# EAGLE design Gamma-BOTTOM-Version2 (EAGLE 9.5.2)
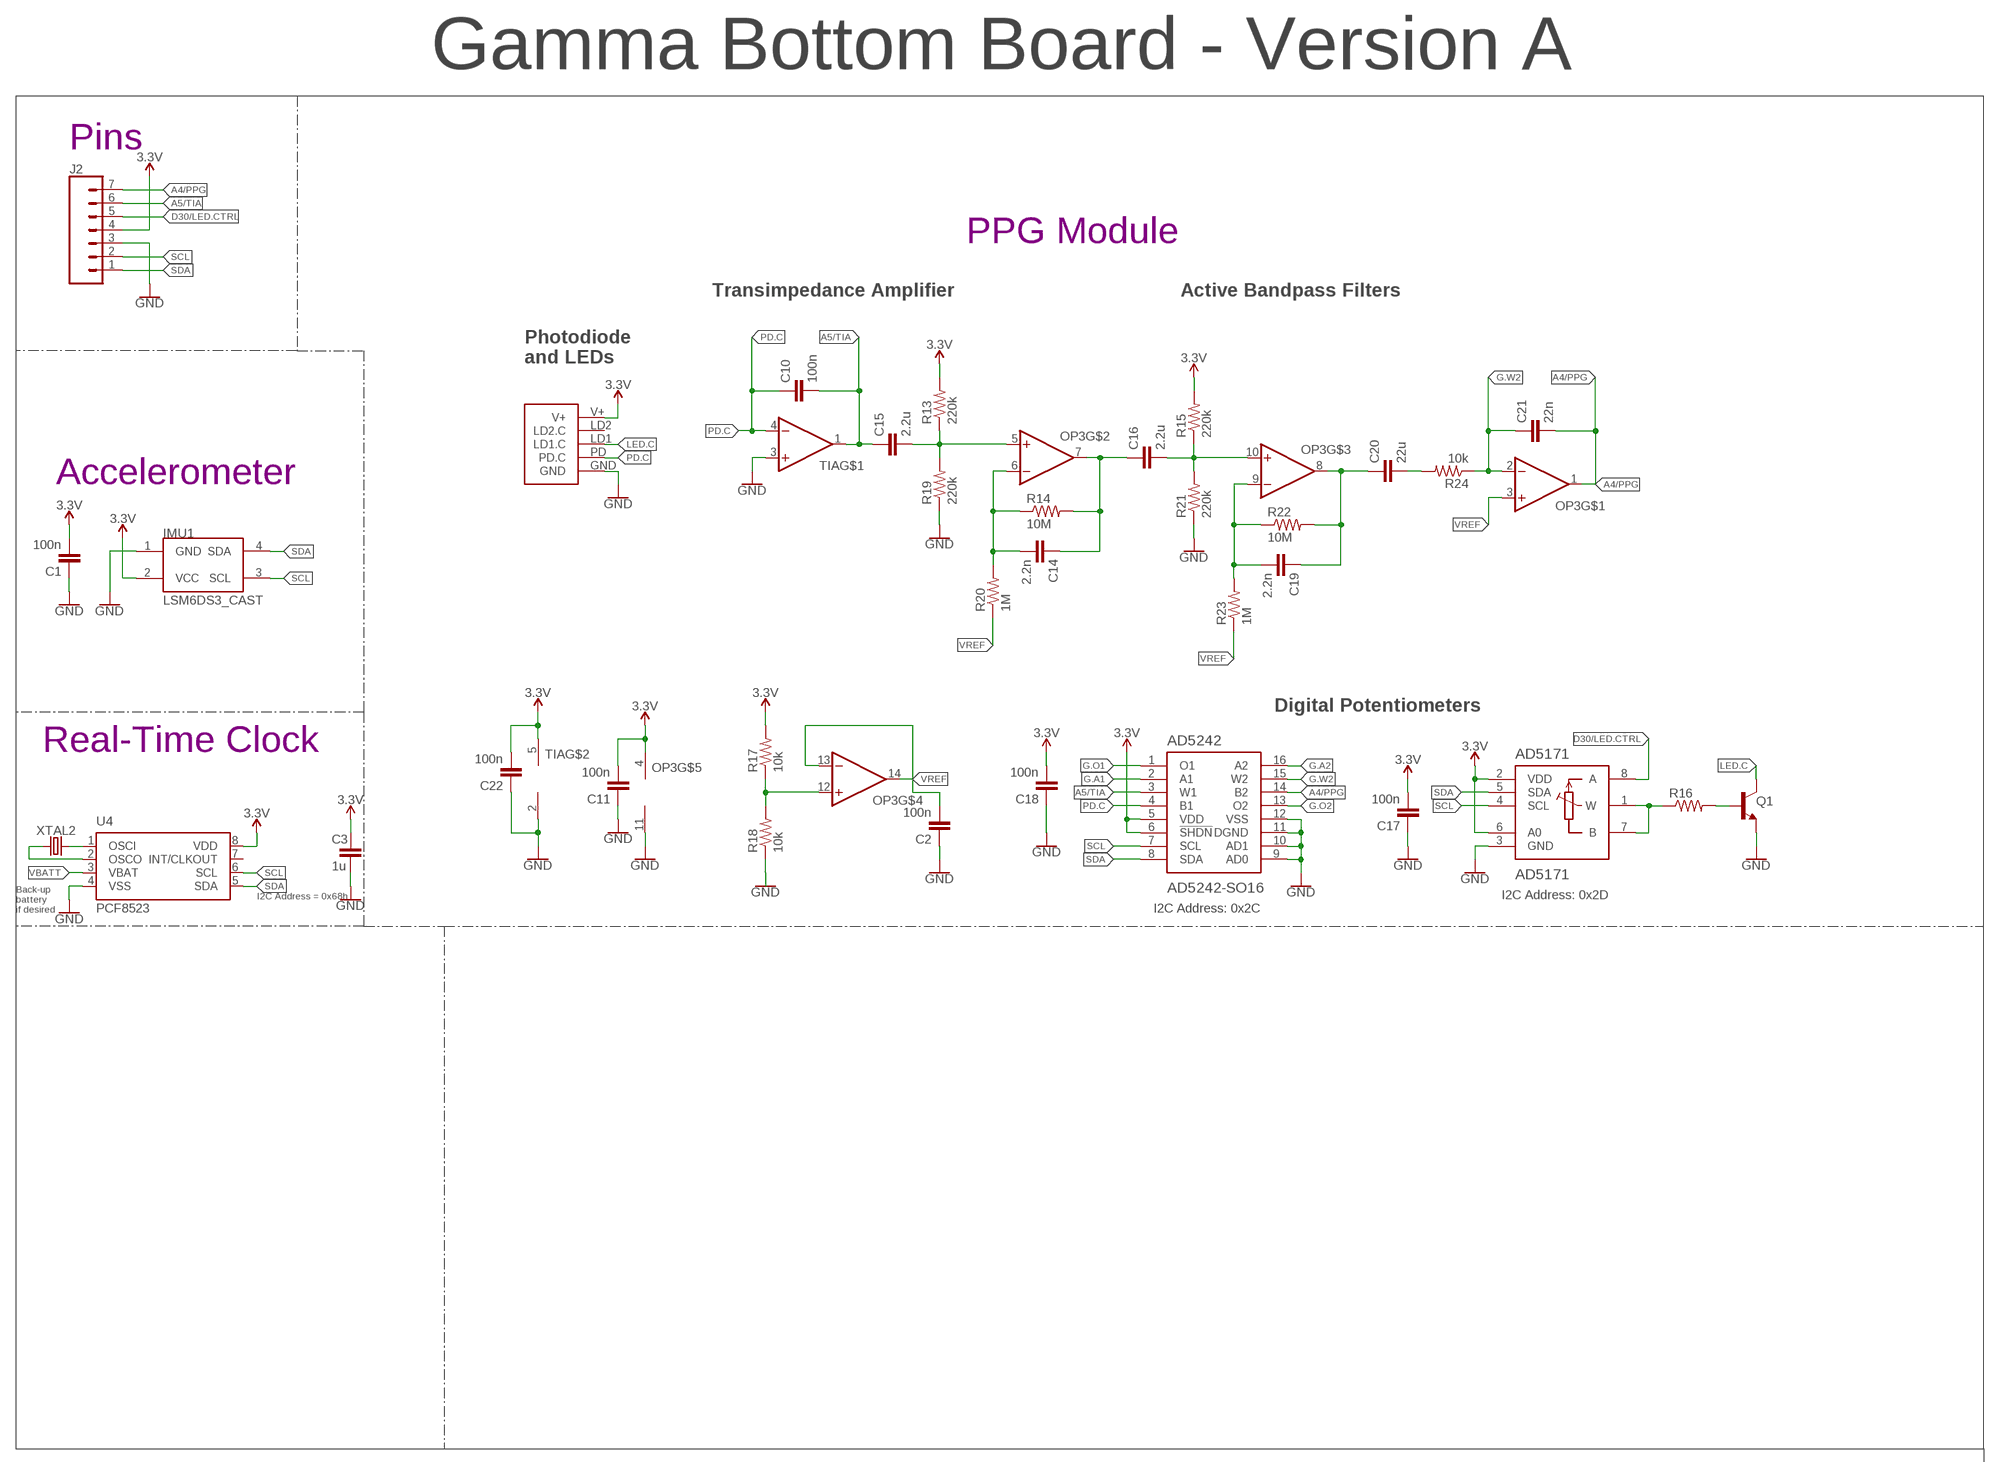
[diagram p0: schematic, sheet 1]

## Parts
AD5171  AD5171  [SOT-23-8]
AD5242  AD5242-SO16  [SO16]
C1  100n  CAPACITOR0603  [C0603]
C2  100n  CAPACITOR0603  [C0603]
C3  1u  CAPACITOR0603  [C0603]
C10  100n  CAPACITOR0603  [C0603]
C11  100n  CAPACITOR0603  [C0603]
C14  2.2n  CAPACITOR0603  [C0603]
C15  2.2u  CAPACITOR0603  [C0603]
C16  2.2u  CAPACITOR0603  [C0603]
C17  100n  CAPACITOR0603  [C0603]
C18  100n  CAPACITOR0603  [C0603]
C19  2.2n  CAPACITOR0603  [C0603]
C20  22u  CAPACITOR0603  [C0603]
C21  22n  CAPACITOR0603  [C0603]
C22  100n  CAPACITOR0603  [C0603]
IMU1  LSM6DS3_CAST  [LSM6DS3_CAST]
J2  CONN_07-1.27MM  [1X07_1.27MM]
OP3  OP-QUAD-SO14  [SO14]
Q1  NPN-GENERIC  [SOT23-3]
R13  220k  RESISTOR0603  [R0603]
R14  10M  RESISTOR0603  [R0603]
R15  220k  RESISTOR0603  [R0603]
R16  RESISTOR0603  [R0603]
R17  10k  RESISTOR0402  [R0402]
R18  10k  RESISTOR0402  [R0402]
R19  220k  RESISTOR0603  [R0603]
R20  1M  RESISTOR0603  [R0603]
R21  220k  RESISTOR0603  [R0603]
R22  10M  RESISTOR0603  [R0603]
R23  1M  RESISTOR0603  [R0603]
R24  10k  RESISTOR0603  [R0603]
TIA  OP-SINGLEOT  [SOT23-5]
U4  PCF8523  [SO8]
U$3  PPG.MODULE.2  [PPG.MODULE.2]
XTAL2  32.7680kHz  CRYSTALECS-.327-12.5-12-C-TR  [2-SMD.NOLEAD.2.0MMTO1.2MM]

## Nets
3.3V: AD5171.2(VDD) AD5171.6(A0) AD5242.5(VDD) AD5242.6(!SHDN) C1.2 C3.1 C11.2 C17.2 C18.2 C22.2 IMU1.2(VCC) J2.4 OP3.4(V+) R13.2 R15.2 R17.2 TIA.5(V+) U4.8(VDD) U$3.V+
A4/PPG: AD5242.14(B2) C21.2 J2.7 OP3.1(OUT)
A5/TIA: AD5242.3(W1) C10.2 C15.1 J2.6 TIA.1(OUT)
D30/LED.CTRL: AD5171.8(A) J2.5
G.A1: AD5242.2(A1)
G.A2: AD5242.16(A2)
G.O1: AD5242.1(O1)
G.O2: AD5242.13(O2)
G.W2: AD5242.15(W2) C21.1 OP3.2(-IN) R24.1
GND: AD5171.3(GND) AD5242.9(AD0) AD5242.10(AD1) AD5242.11(DGND) AD5242.12(VSS) C1.1 C2.1 C3.2 C11.1 C17.1 C18.1 C22.1 IMU1.1(GND) J2.3 OP3.11(V-) Q1.2(E) R18.1 R19.1 R21.1 TIA.2(V-) TIA.3(+IN) U4.4(VSS) U$3.GND
LED.C: Q1.3(C) U$3.LD1(LD1.C)
N$1: U4.2(OSCO) XTAL2.P$1
N$2: U4.1(OSCI) XTAL2.P$2
N$8: Q1.1(B) R16.2
N$9: AD5171.1(W) AD5171.7(B) R16.1
N$10: OP3.12(+IN) R17.1 R18.2
N$13: C15.2 OP3.5(+IN) R13.1 R19.2
N$15: C14.2 OP3.6(-IN) R14.1 R20.2
N$16: C14.1 C16.1 OP3.7(OUT) R14.2
N$17: C16.2 OP3.10(+IN) R15.1 R21.2
N$18: C19.2 OP3.9(-IN) R22.1 R23.2
N$19: C19.1 C20.1 OP3.8(OUT) R22.2
N$20: C20.2 R24.2
PD.C: AD5242.4(B1) C10.1 TIA.4(-IN) U$3.PD(PD.C)
SCL: AD5171.4(SCL) AD5242.7(SCL) IMU1.3(SCL) J2.2 U4.6(SCL)
SDA: AD5171.5(SDA) AD5242.8(SDA) IMU1.4(SDA) J2.1 U4.5(SDA)
VBATT: U4.3(VBAT)
VREF: C2.2 OP3.3(+IN) OP3.13(-IN) OP3.14(OUT) R20.1 R23.1
Unconnected: U4.7(INT/CLKOUT) U$3.LD2(LD2.C)

## Notes on the sheet
- Gamma Bottom Board - Version A
- Pins
- PPG Module
- Transimpedance Amplifier | Active Bandpass Filters
- Photodiode
  and LEDs
- Accelerometer
- Digital Potentiometers
- Real-Time Clock
- I2C Address = 0x68h | I2C Address: 0x2D
- Back-up
  battery
  if desired
- I2C Address: 0x2C

## Library data of the parts
AD5171 = LinnesLab-DigitalIC:AD5171
AD5242 = LinnesLab-DigitalIC:AD5242
C1-C3 C10 C11 C14-C22 = LinnesLab-Passives:CAPACITOR
IMU1 = LinnesLab-Sensors:LSM6DS3_CAST
J2 = LinnesLab-Connectors:CONN_07: Multi connection point. Often used as Generic Header-pin footprint for 0.1 inch spaced/style header connections On any of the 0.1 inch spaced packages, you can populate with these: Break Away Headers - Straight <https://www.sparkfun.com/products/116> (PRT-00116) Break Away Male Headers - Right Angle <https://www.sparkfun.com/products/553> (PRT-00553) Female Headers <https://www.sparkfun.com/products/115> (PRT-00115) Break Away Headers - Machine Pin <https://www.sparkfun.com/products/117> (PRT-00117) Break Away Female Headers - Swiss Machine Pin <https://www.sparkfun.com/products/743> (PRT-00743) For SCREWTERMINALS and SPRING TERMINALS visit here: Screw Terimnals on SparkFun.com <https://www.sparkfun.com/search/results?term=Screw+Terminals> (5mm/3.5mm/2.54mm spacing) This device is also useful as a general connection point to wire up your design to another part of your project. Our various solder wires solder well into these plated through hole pads. Hook-Up Wire - Assortment (Stranded, 22 AWG) <https://www.sparkfun.com/products/11375> (PRT-11375) Hook-Up Wire - Assortment (Solid Core, 22 AWG) <https://www.sparkfun.com/products/11367> (PRT-11367) View the entire wire category on our website here <https://www.sparkfun.com/categories/141> Special notes: Molex polarized connector foot print use with SKU : PRT-08231 with associated crimp pins and housings. 1MM SMD Version SKU: PRT-10208 NOTES ON THE VARIANTS LOCK and LOCK_LONGPADS... This footprint was designed to help hold the alignment of a through-hole component (i.e. 6-pin header) while soldering it into place. You may notice that each hole has been shifted either up or down by 0.005 of an inch from it's more standard position (which is a perfectly straight line). This slight alteration caused the pins (the squares in the middle) to touch the edges of the holes. Because they are alternating, it causes a "brace" to hold the component in place. 0.005 has proven to be the perfect amount of "off-center" position when using our standard breakaway headers. Although looks a little odd when you look at the bare footprint, once you have a header in there, the alteration is very hard to notice. Also,if you push a header all the way into place, it is covered up entirely on the bottom side.
OP3 = LinnesLab-AnalogIC:OP-QUAD: General symbol and footprints for Quad Op Amps. Use with any standard general purpose op amp.
Q1 = LinnesLab-DiscreteSemi:NPN
R13-R24 = LinnesLab-Passives:RESISTOR
TIA = LinnesLab-AnalogIC:OP-SINGLE: Single Op Amp 2.7V to 6.0V Single Supply CMOS Source: http://ww1.microchip.com/downloads/en/DeviceDoc/21314g.pdf
U4 = LinnesLab-Clocks:PCF8523; DIGIKEY: 568-5306-1-ND; I2C_ADDRESS: 0x68h; MFN: PCF8523T/1,118; MFN_MANUFACTURER: NXP USA Inc.
U$3 = LinnesLab-Connectors:PPG.MODULE.2: Digi-Key Part Number: S9014E-50-ND Manufacturer Part Number: GRPB501VWVN-RC Description: 1mm insulation height 0.05in pitch 50 positions
XTAL2 = LinnesLab-Clocks:CRYSTAL; DIGIKEY: XC2288CT-ND; FREQ: 32.7680KHZ; LOAD_CAP: 12.5pF

## Board
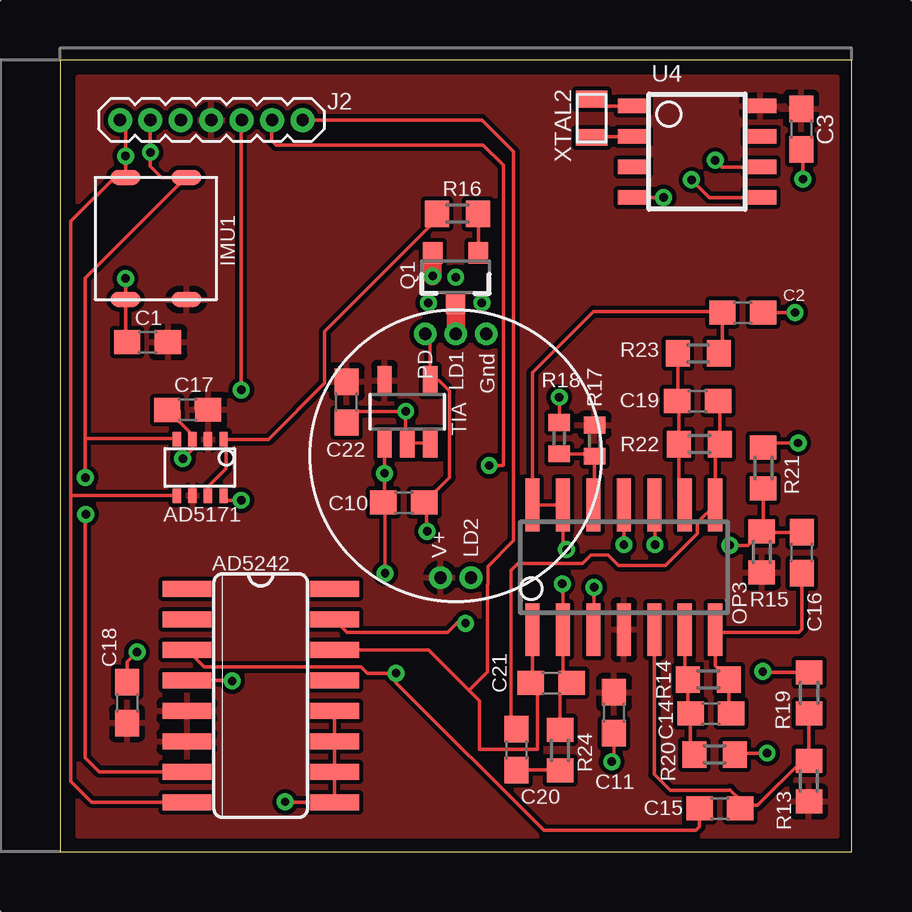
[diagram p1: board, top side]
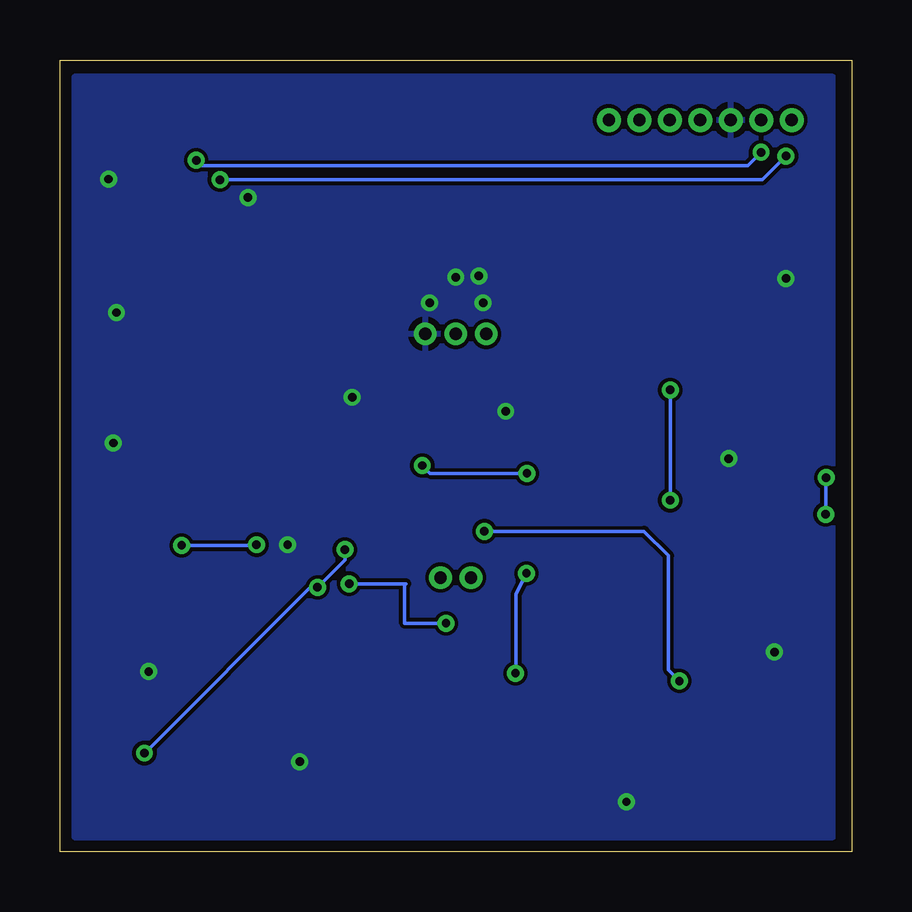
[diagram p2: board, bottom side, seen from below]

Size 33 x 33 mm. Coordinates in mm from the lower left corner, seen from the top.
Outline: 0,0 33,0 33,33 0,33 0,0
Copper layers (1*16): Top 0.0356mm / dielectric 1.5011mm / Bottom 0.0356mm
Design rules "LaenPCBOrder": minimum track width 6mil, minimum drill 13mil, track to track 6mil, track to pad 6mil, pad to pad 6mil, via to via 6mil, smd to smd 6mil, copper to edge 15mil, drill to drill 6mil, minimum pad ring 7mil, minimum via ring 7mil, stop-mask expansion 3mil, vias tented up to drill 0mil, thermal gap 10mil

### Footprints (pad centres in the part's own frame; a part is rotated, then mirrored left to right if it is on the bottom)
SOT-23-8 = smd 0.35 x 0.6: 1 -0.991,-1.176; 2 -0.341,-1.176; 3 0.309,-1.176; 4 0.959,-1.176; 5 0.959,1.176; 6 0.309,1.176; 7 -0.341,1.176; 8 -0.991,1.176
SO16 = smd 0.66 x 2.032: 1 -4.445,-3.073; 2 -3.175,-3.073; 3 -1.905,-3.073; 4 -0.635,-3.073; 5 0.635,-3.073; 6 1.905,-3.073; 7 3.175,-3.073; 8 4.445,-3.073; 9 4.445,3.073; 10 3.175,3.073; 11 1.905,3.073; 12 0.635,3.073; 13 -0.635,3.073; 14 -1.905,3.073; 15 -3.175,3.073; 16 -4.445,3.073
C0603 = smd 1.1 x 1: 1 -0.85,0; 2 0.85,0
LSM6DS3_CAST = smd 0.635 x 1.27: 1 -2.54,1.27; 2 -2.54,-1.27; 3 2.54,-1.27; 4 2.54,1.27
1X07_1.27MM = drill 0.508 pad 1: 1 0,0; 2 1.27,0; 3 2.54,0; 4 3.81,0; 5 5.08,0; 6 6.35,0; 7 7.62,0
SO14 = smd 0.6 x 2.2: 1 -3.81,-2.6; 2 -2.54,-2.6; 3 -1.27,-2.6; 4 0,-2.6; 5 1.27,-2.6; 6 2.54,-2.6; 7 3.81,-2.6; 8 3.81,2.6; 9 2.54,2.6; 10 1.27,2.6; 11 0,2.6; 12 -1.27,2.6; 13 -2.54,2.6; 14 -3.81,2.6
SOT23-3 = smd 0.8 x 0.9: 1 -0.95,-1; 2 0.95,-1; 3 0,1.1
R0603 = smd 1 x 1.1: 1 -0.85,0; 2 0.85,0
R0402 = smd 0.7 x 0.9: 1 -0.65,0; 2 0.65,0
SOT23-5 = smd 0.6 x 1.2: 1 -0.95,-1.306; 2 0,-1.306; 3 0.95,-1.306; 4 0.95,1.306; 5 -0.95,1.306
SO8 = smd 1.3 x 0.6: 1 -2.65,1.905; 2 -2.65,0.635; 3 -2.65,-0.635; 4 -2.65,-1.905; 5 2.65,-1.905; 6 2.65,-0.635; 7 2.65,0.635; 8 2.65,1.905
PPG.MODULE.2 = drill 0.508 pad 0.94: GND 1.27,5.08; LD1 0,5.08; LD2 0.635,-5.08; PD -1.27,5.08; V+ -0.635,-5.08
2-SMD.NOLEAD.2.0MMTO1.2MM = smd 0.7 x 1.3: P$1 -0.8,0; P$2 0.8,0

### Placement (x,y rotation side)
AD5171  5.83,16.01 180 top
AD5242  8.37,6.5 270 top
C1  3.65,21.23 0 top
C2  28.46,22.47 180 top
C3  30.9,30.11 270 top
C10  14.34,14.55 180 top
C11  23.1,5.79 90 top
C14  27.14,5.75 180 top
C15  27.51,1.79 0 top
C16  30.93,12.46 90 top
C17  5.32,18.41 0.4 top
C18  2.8,6.2 270 top
C19  26.58,18.79 180 top
C20  19.02,4.25 270 top
C21  20.48,7.02 180 top
C22  11.95,18.73 90 top
IMU1  4,25.56 90 top
J2  2.5,30.5 0 top
OP3  23.51,11.85 0 top
Q1  16.49,23.96 180 top
R13  31.23,2.94 270 top
R14  27.03,7.17 0 top
R15  29.25,12.49 270 top
R16  16.57,26.59 0 top
R17  22.29,17.13 90 top
R18  20.82,17.23 270 top
R19  31.23,6.62 270 top
R20  27.29,4.05 180 top
R21  29.32,15.99 270 top
R22  26.65,16.98 0 top
R23  26.61,20.76 180 top
R24  20.85,4.23 270 top
TIA  14.48,18.33 0 top
U4  26.56,29.17 0 top
U$3  16.5,16.5 0 top
XTAL2  22.16,30.57 90 top

### Tracks (layer width: path | path; a pad name or v marks a point on that pad's centre or on a via)
3.3V
  pour Top (isolate 0.178): 0.9,32.27 32.37,32.27 32.37,32.2 32.37,0.65 32.04,0.65 0.78,0.65 0.78,32.27
A4/PPG
  Top 0.152: AD5242.14 15.38,8.4 17.06,6.72 | 17.06,6.72 17.49,6.29 17.49,4.26 19.9,4.26 19.9,6.75 C21.2 19.7,7.09 OP3.1 | 17.06,6.72 17.82,7.48 17.82,11.12 17.83,11.13 17.83,11.89 18.91,12.97 18.91,29.17 17.59,30.5 J2.7
A5/TIA  (via drill 0.35)
  Top 0.152: TIA.1 v13.53,15.76 13.53,14.59 C10.2 13.55,14.48 v13.55,11.6 | v17.9,16.09 18.45,16.09 18.48,16.12 18.48,28.61 17.64,29.45 9.01,29.45 8.83,29.63 8.83,30.48 J2.6 | AD5242.3 6.01,7.69 12.55,7.69 12.81,7.43 v14.01,7.43 14.01,7.04 20.17,0.88 26.51,0.88 26.66,1.03 C15.1
  Bottom 0.152: v17.9,16.09 17.57,15.76 v13.53,15.76 | v13.55,11.6 13.98,10.73 13.98,7.43 v14.01,7.43
D30/LED.CTRL  (via drill 0.35)
  Top 0.152: v7.56,14.64 7.01,14.64 AD5171.8 | v7.56,19.24 7.56,30.48 J2.5
  Bottom 0.152: v7.56,14.64 v7.56,19.24
G.W2  (via drill 0.35)
  Top 0.152: R24.1 20.85,6.54 C21.1 20.97,7.38 OP3.2 20.97,11.14 v20.94,11.16 | AD5242.15 11.98,9.14 16.15,9.14 16.63,9.62 16.8,9.62 v16.91,9.51
  Bottom 0.152: v20.94,11.16 18.58,11.16 18.63,11.11 18.63,9.51 v16.91,9.51
GND  (via drill 0.35)
  Top 0.152: v20.82,18.94 R18.1 | OP3.11 v23.51,12.79 | R21.1 29.51,17.03 v30.77,17.03 | v29.3,7.51 29.34,7.47 R19.1 | C11.1 23.1,3.85 v23,3.75 | C22.1 12.42,18.35 v14.42,18.35 14.42,17.09 TIA.2 TIA.3 | AD5242.12 AD5242.11 AD5242.10 AD5242.9 9.41,2.05 v9.39,2.07 | v3.21,8.32 2.8,7.9 C18.1 | v2.73,23.89 IMU1.1 2.73,21.3 C1.1 | C17.1 5.52,17.36 AD5171.3 5.52,16.78 v5.12,16.38 | C2.1 v30.65,22.47 | C3.2 30.98,29.19 v30.98,28.03 | U4.4 v25.16,27.27
  Top 0.762: Q1.2 v15.54,24 v15.53,23.99
  other vias: 17.59,22.87 15.36,22.87 16.5,23.94
  pour Bottom: 0.78,32.3 32.4,32.3 32.4,32.22 32.4,0.6 0.78,0.6
LED.C
  Top 0.508: Q1.3
  Top 0.762: Q1.3 U$3.LD1
N$1
  Top 0.152: U4.2 22.2,29.81 XTAL2.P$1
N$2
  Top 0.152: U4.1 22.45,31.08 XTAL2.P$2
N$8
  Top 0.152: Q1.1 17.44,26.57 R16.2
N$9
  Top 0.152: R16.1 15.72,26.36 11.04,21.68 11.04,19.52 8.7,17.19 AD5171.1 6.92,17.09 6.92,15.97 6.17,15.21 AD5171.7
N$10
  Top 0.152: R18.2 22.19,16.58 R17.1 22.29,14.5 OP3.12
N$13
  Top 0.152: R19.2 31.23,3.85 | 31.23,3.85 R13.1 | 31.23,3.85 31,3.85 29.07,1.92 28.49,1.92 C15.2 28.36,2.15 27.93,2.58 27.9,2.55 25.44,2.55 24.78,3.21 OP3.5
N$15
  Top 0.152: OP3.6 26.05,7.31 R14.1 26.18,5.85 C14.2 26.29,4.21 R20.2
N$16
  Top 0.152: OP3.7 27.32,9.16 | 27.32,9.16 27.32,7.74 R14.2 27.89,5.85 C14.1 | C16.1 30.93,9.26 30.8,9.13 27.34,9.13 27.32,9.16
N$17  (via drill 0.35)
  Top 0.152: C16.2 29.28,13.31 R15.1 | R21.2 29.32,13.4 R15.1 | R15.1 28.68,12.77 v27.93,12.77 | v24.8,12.79 24.8,14.43 OP3.10
  Bottom 0.152: v27.93,12.77 24.83,12.77 v24.8,12.79
N$18
  Top 0.152: OP3.9 25.8,14.7 R22.1 25.8,18.72 C19.2 25.76,18.81 R23.2
N$19
  Top 0.152: C20.1 18.91,5.1 18.81,5.2 18.81,11.72 19.09,12 21.78,12 22.14,12.36 22.85,12.36 23.28,11.93 25.25,11.93 26.58,13.26 26.58,13.71 OP3.8 27.32,16.8 R22.2 27.5,18.72 C19.1
N$20
  Top 0.152: R24.2 20.83,3.4 C20.2
PD.C  (via drill 0.35)
  Top 0.152: U$3.PD 15.43,21.38 TIA.4 15.8,19.64 16.25,19.19 16.25,15.6 C10.1 15.26,14.48 v15.3,13.35 | AD5242.4 7.15,7.13 v7.18,7.11
  Bottom 0.152: v7.18,7.11 7.63,7.57 7.63,12.33 8.65,13.35 v15.3,13.35
SCL  (via drill 0.35)
  Top 0.152: J2.2 v3.77,29.15 3.77,28.57 4.24,28.1 IMU1.3 5.25,28.1 1.06,23.91 1.06,17.18 | AD5242.7 1.63,3.32 1.06,3.9 1.06,14.04 v1.08,14.06 | v1.06,15.59 1.06,17.18 | 1.06,17.18 1.08,17.21 4.85,17.21 AD5171.4 | U4.6 27.6,28.54 v27.32,28.82
  Bottom 0.152: v1.08,14.06 1.08,15.56 v1.06,15.59 | v27.32,28.82 27.09,28.59 4.33,28.59 v3.77,29.15
SDA  (via drill 0.35)
  Top 0.152: J2.1 2.73,30.27 v2.73,29 IMU1.4 2.5,28.33 0.46,26.29 0.46,14.82 | AD5242.8 1.33,2.05 0.46,2.92 0.46,14.82 | 0.46,14.82 0.47,14.84 AD5171.5 | v26.33,28 27.07,27.27 U4.5
  Bottom 0.152: v26.33,28 3.72,28 v2.73,29
VREF  (via drill 0.35)
  Top 0.152: R20.1 28.2,4.1 v29.48,4.1 | v22.27,11.01 22.27,9.28 OP3.3 | v21.12,12.59 20.97,12.74 OP3.13 OP3.14 19.7,19.98 22.24,22.52 27.56,22.52 C2.2 27.61,20.92 R23.1
  Bottom 0.152: v29.48,4.1 22.57,11.01 v22.27,11.01 21.12,12.16 v21.12,12.59